# Altium schematic sheet Sheet1.SchDoc
size A4; SheetNumber: 1; SheetTotal: 1
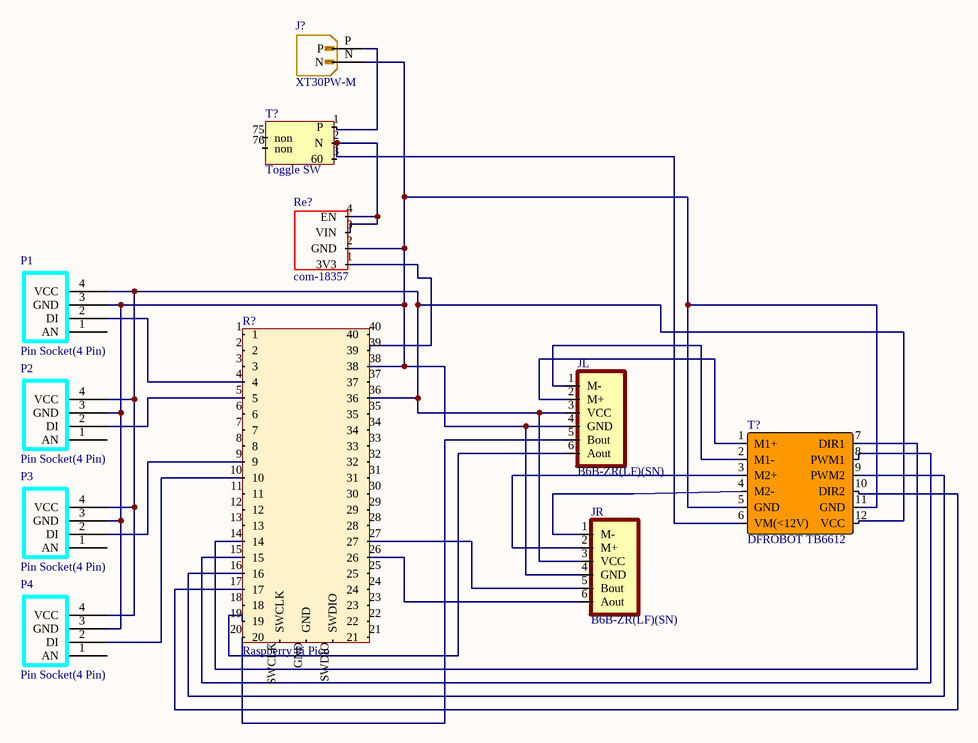
[diagram p0: Sheet1.SchDoc]

## Parts
(Parts that share a designator on the sheet are numbered #1, #2 ... from top to bottom, then left to right.)
J?  XT30PW-M  [AMASS_XT30PW-M]
JL  B6B-ZR(LF)(SN)  [JST_B6B-ZR(LF)(SN)]
JR  B6B-ZR(LF)(SN)  [JST_B6B-ZR(LF)(SN)]
P1  Pin Socket(4 Pin)  [IR]
P2  Pin Socket(4 Pin)  [IR]
P3  Pin Socket(4 Pin)  [IR]
P4  Pin Socket(4 Pin)  [IR]
R?  Raspberry Pi Pico  [Raspberry Pi Pico]
Re?  com-18357  [Regulator]
T?#1  Toggle SW  [Torrle SW]
T?#2  DFROBOT TB6612  [DFROBOT TB6612]

## Nets
NetJ?_N: J?.N JL.4(GND) JR.4(GND) P1.3(GND) P2.3(GND) P3.3(GND) P4.3(GND) R?.38 Re?.2(GND) T?#2.5(GND) T?#2.11(GND)
NetJ?_P: J?.P T?#1.1(P)
NetJL_1: JL.1(M-) T?#2.2(M1-)
NetJL_2: JL.2(M+) T?#2.1(M1+)
NetJL_3: JL.3(VCC) JR.3(VCC) P1.4(VCC) P2.4(VCC) P3.4(VCC) P4.4(VCC) R?.36 T?#2.12(VCC)
NetJL_5: JL.5(Bout) R?.20
NetJL_6: JL.6(Aout) R?.19
NetJR_1: JR.1(M-) T?#2.4(M2-)
NetJR_2: JR.2(M+) T?#2.3(M2+)
NetJR_5: JR.5(Bout) R?.27
NetJR_6: JR.6(Aout) R?.26
NetP1_2: P1.2(DI) R?.4
NetP2_2: P2.2(DI) R?.5
NetP3_2: P3.2(DI) R?.9
NetP4_2: P4.2(DI) R?.10
NetR?_14: R?.14 T?#2.7(DIR1)
NetR?_15: R?.15 T?#2.8(PWM1)
NetR?_16: R?.16 T?#2.9(PWM2)
NetR?_17: R?.17 T?#2.10(DIR2)
NetR?_39: R?.39 Re?.1(3V3)
NetRe?_3: Re?.3(VIN) Re?.4(EN) T?#1.2(N) T?#2.6(VM(<12V))

Not connected (* = marked no-connect by the designer): P1 1(AN); P2 1(AN); P3 1(AN); P4 1(AN); R? 1 2 3 6 7 8 11 12 13 18 21 22 23 24 25 28 29 30 31 32 33 34 35 37 40 GND SWCLK SWDIO; T?#1 3(60) 75(non) 76(non)

## Library data of the parts
J? = XT30PW-M: Socket; DC supply; XT30; male; PIN: 2; on PCBs; THT; Colour: yellow; MF: AMASS; Package: None; Price: None; Value: *; SnapEDA_Link: https://www.snapeda.com/parts/XT30PW-M/AMASS/view-part/?ref=snap; MP: XT30PW-M; Availability: Not in stock; Check_prices: https://www.snapeda.com/parts/XT30PW-M/AMASS/view-part/?ref=eda
JL JR = B6B-ZR(LF)(SN): Connector Header Through Hole 6 position 0.059 (1.50mm); MF: JST Sales; SnapEDA_Link: https://www.snapeda.com/parts/B6B-ZR(LF)(SN)/JST+Sales+America+Inc./view-part/?ref=snap; Digi-Key_Part_Number: 455-1661-ND; Value: *; MP: B6B-ZR(LF)(SN); Package: None; Purchase-URL: https://pricing.snapeda.com/search/part/B6B-ZR(LF)(SN)/?ref=eda; Check_prices: https://www.snapeda.com/parts/B6B-ZR(LF)(SN)/JST+Sales+America+Inc./view-part/?ref=eda
P1-P4 = IR
Re? = Regulator